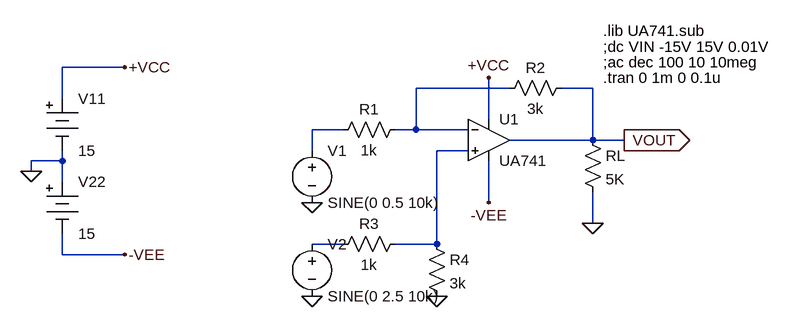
[diagram p0: schematic lab2.asc]
lab2.asc, the LTspice schematic file:
Version 4
SHEET 1 880 680
WIRE -384 32 -480 32
WIRE 208 64 64 64
WIRE 336 64 288 64
WIRE -480 80 -480 32
WIRE 176 112 176 48
WIRE -48 128 -96 128
WIRE 64 128 64 64
WIRE 64 128 32 128
WIRE 144 128 64 128
WIRE 336 144 336 64
WIRE 336 144 208 144
WIRE 384 144 336 144
WIRE -96 160 -96 128
WIRE 144 160 96 160
WIRE -480 176 -480 160
WIRE -480 176 -528 176
WIRE -528 192 -528 176
WIRE -480 208 -480 176
WIRE 176 240 176 176
WIRE 336 272 336 224
WIRE -48 304 -96 304
WIRE 96 304 96 160
WIRE 96 304 32 304
WIRE -480 320 -480 288
WIRE -384 320 -480 320
FLAG -528 192 0
FLAG 336 272 0
FLAG -384 32 +VCC
FLAG 176 48 +VCC
FLAG -384 320 -VEE
FLAG 176 240 -VEE
FLAG 384 144 VOUT
IOPIN 384 144 Out
FLAG -96 240 0
FLAG -96 384 0
FLAG 96 384 0
SYMBOL Opamps\\opamp2 176 80 R0
SYMATTR InstName U1
SYMATTR Value UA741
SYMBOL res 320 128 R0
SYMATTR InstName RL
SYMATTR Value 5K
SYMBOL Misc\\battery -480 64 R0
WINDOW 123 0 0 Left 2
WINDOW 39 0 0 Left 2
SYMATTR InstName V11
SYMATTR Value 15
SYMBOL Misc\\battery -480 192 R0
WINDOW 123 0 0 Left 2
WINDOW 39 0 0 Left 2
SYMATTR InstName V22
SYMATTR Value 15
SYMBOL res 304 48 R90
WINDOW 0 0 56 VBottom 2
WINDOW 3 32 56 VTop 2
SYMATTR InstName R2
SYMATTR Value 3k
SYMBOL res 48 112 R90
WINDOW 0 0 56 VBottom 2
WINDOW 3 32 56 VTop 2
SYMATTR InstName R1
SYMATTR Value 1k
SYMBOL voltage -96 144 R0
WINDOW 123 0 0 Left 2
WINDOW 39 0 0 Left 2
SYMATTR InstName V1
SYMATTR Value SINE(0 0.5 10k)
SYMBOL res 48 288 R90
WINDOW 0 0 56 VBottom 2
WINDOW 3 32 56 VTop 2
SYMATTR InstName R3
SYMATTR Value 1k
SYMBOL voltage -96 288 R0
WINDOW 123 0 0 Left 2
WINDOW 39 0 0 Left 2
SYMATTR InstName V2
SYMATTR Value SINE(0 2.5 10k)
SYMBOL res 80 288 R0
SYMATTR InstName R4
SYMATTR Value 3k
TEXT 352 -24 Left 2 !.lib UA741.sub
TEXT 352 0 Left 2 !;dc VIN -15V 15V 0.01V
TEXT 352 24 Left 2 !;ac dec 100 10 10meg
TEXT 352 48 Left 2 !.tran 0 1m 0 0.1u

The netlist it stands for:
* lab2.asc
XU1 N003 N001 +VCC -VEE VOUT UA741  ; pins In+ In- V+ V- OUT
RL VOUT 0 5K
V11 +VCC 0 15
V22 0 -VEE 15
R2 VOUT N001 3k
R1 N001 N002 1k
V1 N002 0 SINE(0 0.5 10k)
R3 N003 N004 1k
V2 N004 0 SINE(0 2.5 10k)
R4 N003 0 3k
.lib UA741.sub
;dc VIN -15V 15V 0.01V
;ac dec 100 10 10meg
.tran 0 1m 0 0.1u
.backanno
.end